# EAGLE design RAMPS2 (EAGLE 7.5.0)
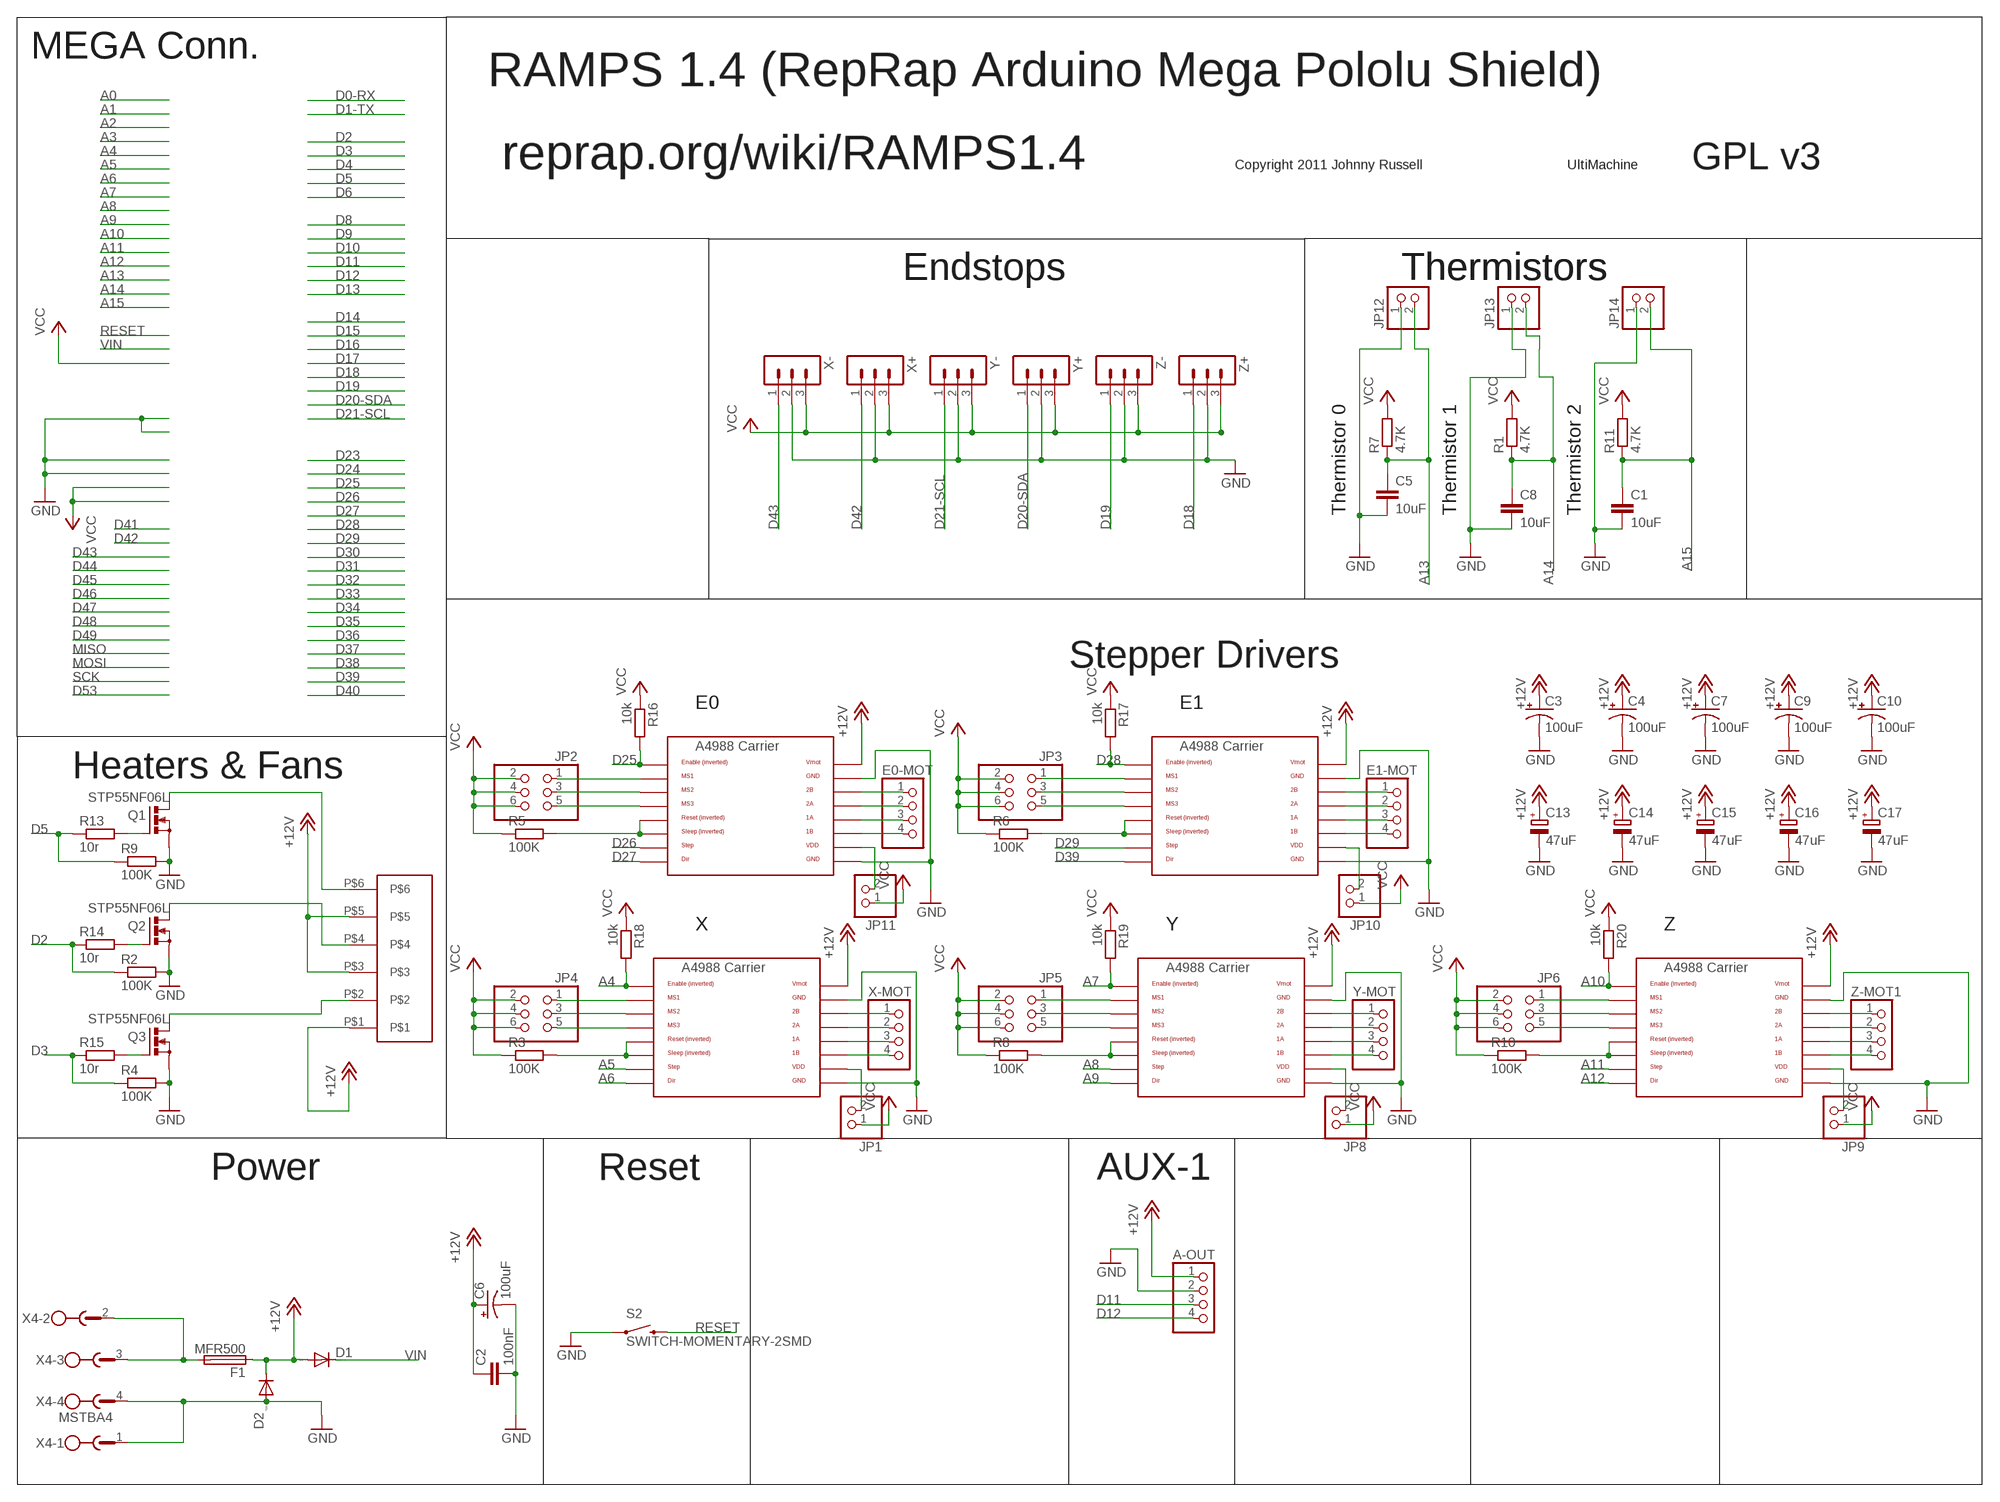
[diagram p0: schematic, sheet 1, part 1 of 3]
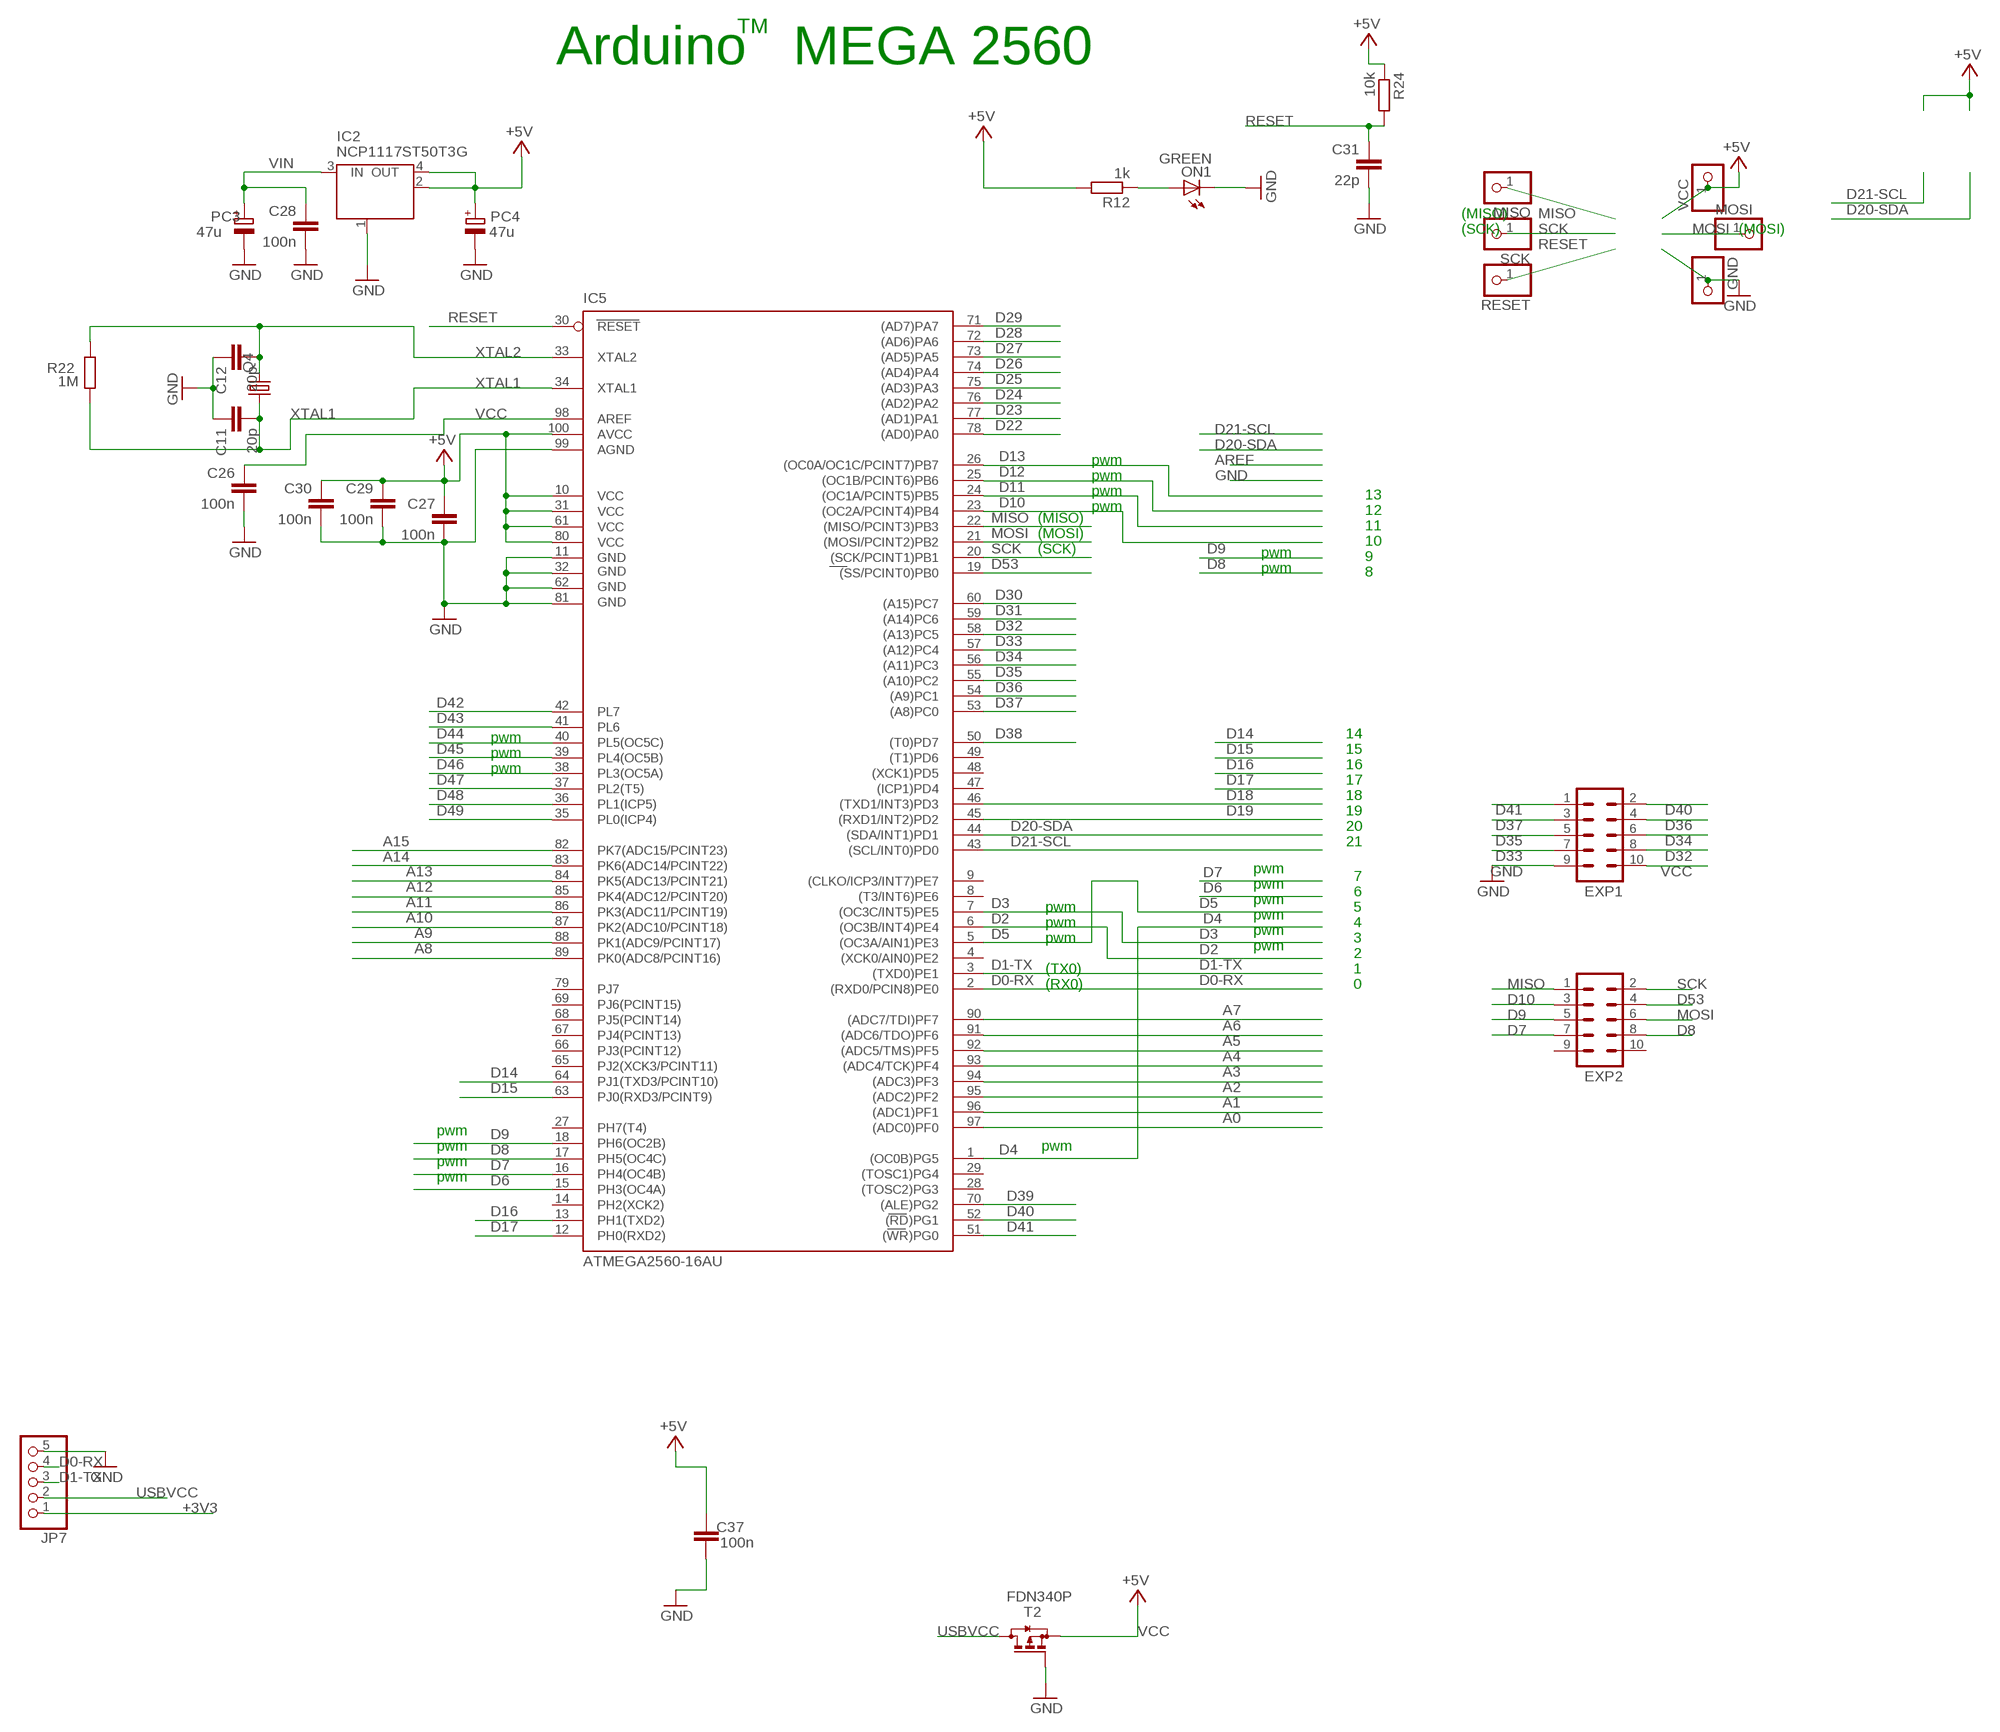
[diagram p1: schematic, sheet 1, part 2 of 3]
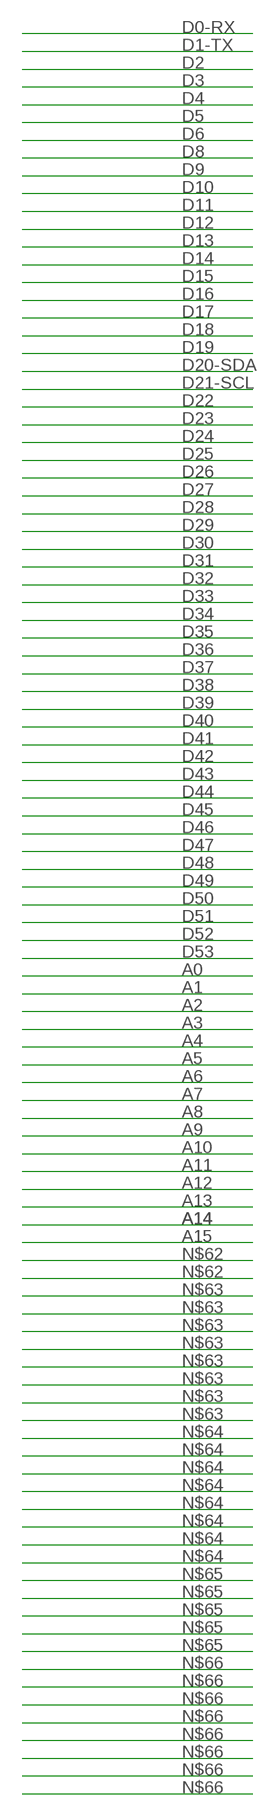
[diagram p2: schematic, sheet 1, part 3 of 3]

## Parts
A-OUT  PINHD-1X4  [1X04]
C1  10uF  C-EUC0805  [C0805]
C2  100nF  C-EUC0805  [C0805]
C3  100uF  CPOL-US153CLV-0605  [153CLV-0605]
C4  100uF  CPOL-US153CLV-0605  [153CLV-0605]
C5  10uF  C-EUC0805  [C0805]
C6  100uF  CPOL-US153CLV-0605  [153CLV-0605]
C7  100uF  CPOL-US153CLV-0605  [153CLV-0605]
C8  10uF  C-EUC0805  [C0805]
C9  100uF  CPOL-US153CLV-0605  [153CLV-0605]
C10  100uF  CPOL-US153CLV-0605  [153CLV-0605]
C11  20p  C-EUC0805  [C0805]
C12  20p  C-EUC0805  [C0805]
C13  47uF  CPOL-EUSMCE  [SMC_E]
C14  47uF  CPOL-EUSMCE  [SMC_E]
C15  47uF  CPOL-EUSMCE  [SMC_E]
C16  47uF  CPOL-EUSMCE  [SMC_E]
C17  47uF  CPOL-EUSMCE  [SMC_E]
C26  100n  C-EUC0805  [C0805]
C27  100n  C-EUC0805  [C0805]
C28  100n  C-EUC0603  [C0603]
C29  100n  C-EUC0805  [C0805]
C30  100n  C-EUC0805  [C0805]
C31  22p  C-EUC0805  [C0805]
C37  100n  C-EUC0805  [C0805]
D1  DIODE-DO-214AC  [DO-214AC]
D2  DIODE-DO-214AC  [DO-214AC]
E0-MOT  PINHD-1X4  [1X04]
E1-MOT  PINHD-1X4  [1X04]
EXP1  ML10  [ML10]
EXP2  ML10  [ML10]
F1  MFR500  PTCFUSE  [MFR500]
GND  PINHD-1X1  [1X01]
IC2  NCP1117ST50T3G  MC33269ST-3.3T3  [SOT223]
IC5  ATMEGA2560-16AU  ATMEGA25602560-16AU  [TQFP100]
JP1  PINHD-1X2  [1X02]
JP2  PINHD-2X3  [2X03]
JP3  PINHD-2X3  [2X03]
JP4  PINHD-2X3  [2X03]
JP5  PINHD-2X3  [2X03]
JP6  PINHD-2X3  [2X03]
JP7  PINHD-1X5  [1X05]
JP8  PINHD-1X2  [1X02]
JP9  PINHD-1X2  [1X02]
JP10  PINHD-1X2  [1X02]
JP11  PINHD-1X2  [1X02]
JP12  PINHD-1X2  [1X02]
JP13  PINHD-1X2  [1X02]
JP14  PINHD-1X2  [1X02]
MISO  PINHD-1X1  [1X01]
MOSI  PINHD-1X1  [1X01]
ON1  GREEN  LED1206  [LED1206]
PC3  47u  CPOL-EUD  [PANASONIC_D]
PC4  47u  CPOL-EUD  [PANASONIC_D]
Q1  STP55NF06L  IRF512  [TO220BV]
Q2  STP55NF06L  IRF512  [TO220BV]
Q3  STP55NF06L  IRF512  [TO220BV]
Q4  CRYSTALHC49S  [HC49/S]
R1  4.7K  R-EU_R0805  [R0805]
R2  100K  R-EU_R0805  [R0805]
R3  100K  R-EU_R0805  [R0805]
R4  100K  R-EU_R0805  [R0805]
R5  100K  R-EU_R0805  [R0805]
R6  100K  R-EU_R0805  [R0805]
R7  4.7K  R-EU_R0805  [R0805]
R8  100K  R-EU_R0805  [R0805]
R9  100K  R-EU_R0805  [R0805]
R10  100K  R-EU_R0805  [R0805]
R11  4.7K  R-EU_R0805  [R0805]
R12  1k  R-EU_R0805  [R0805]
R13  10r  R-EU_R0805  [R0805]
R14  10r  R-EU_R0805  [R0805]
R15  10r  R-EU_R0805  [R0805]
R16  10k  R-EU_R0805  [R0805]
R17  10k  R-EU_R0805  [R0805]
R18  10k  R-EU_R0805  [R0805]
R19  10k  R-EU_R0805  [R0805]
R20  10k  R-EU_R0805  [R0805]
R22  1M  R-EU_R0805  [R0805]
R24  10k  R-EU_R0805  [R0805]
RESET  PINHD-1X1  [1X01]
S2  SWITCH-MOMENTARY-2SMD  [TACTILE-SWITCH-SMD]
SCK  PINHD-1X1  [1X01]
T2  FDN340P  BSS84  [SOT23]
U$2  282837-6  [282837-6]
U$4  A4988BREAKOUT  [A4988BREAKOUT]
U$5  A4988BREAKOUT  [A4988BREAKOUT]
U$6  A4988BREAKOUT  [A4988BREAKOUT]
U$7  A4988BREAKOUT  [A4988BREAKOUT]
U$8  A4988BREAKOUT  [A4988BREAKOUT]
VCC  PINHD-1X1  [1X01]
X4  MSTBA4  [MSTBA4]
X+  3PIN-HEADER  [3PIN-HEADER]
X-  3PIN-HEADER  [3PIN-HEADER]
X-MOT  PINHD-1X4  [1X04]
Y+  3PIN-HEADER  [3PIN-HEADER]
Y-  3PIN-HEADER  [3PIN-HEADER]
Y-MOT  PINHD-1X4  [1X04]
Z+  3PIN-HEADER  [3PIN-HEADER]
Z-  3PIN-HEADER  [3PIN-HEADER]
Z-MOT1  PINHD-1X4  [1X04]

## Nets
+3V3 [power]: JP7.1
+12V: A-OUT.1 C2.1 C3.+ C4.+ C6.+ C7.+ C9.+ C10.+ C13.+ C14.+ C15.+ C16.+ C17.+ D1.A D2.C F1.1 U$2.P$1 U$2.P$3 U$2.P$5 U$4.VMOT U$5.VMOT U$6.VMOT U$7.VMOT U$8.VMOT
A0: IC5.97((ADC0)PF0)
A1: IC5.96((ADC1)PF1)
A2: IC5.95((ADC2)PF2)
A3: IC5.94((ADC3)PF3)
A4: IC5.93((ADC4/TCK)PF4) R18.2 U$6.EN
A5: IC5.92((ADC5/TMS)PF5) U$6.STEP
A6: IC5.91((ADC6/TDO)PF6) U$6.DIR
A7: IC5.90((ADC7/TDI)PF7) R19.2 U$7.EN
A8: IC5.89(PK0(ADC8/PCINT16)) U$7.STEP
A9: IC5.88(PK1(ADC9/PCINT17)) U$7.DIR
A10: IC5.87(PK2(ADC10/PCINT18)) R20.2 U$8.EN
A11: IC5.86(PK3(ADC11/PCINT19)) U$8.STEP
A12: IC5.85(PK4(ADC12/PCINT20)) U$8.DIR
A13: C5.1 IC5.84(PK5(ADC13/PCINT21)) JP12.2 R7.1
A14: C8.1 IC5.83(PK6(ADC14/PCINT22)) JP13.2 R1.1
A15: C1.1 IC5.82(PK7(ADC15/PCINT23)) JP14.2 R11.1
D0-RX: IC5.2((RXD0/PCIN8)PE0) JP7.4
D1-TX: IC5.3((TXD0)PE1) JP7.3
D2: IC5.6((OC3B/INT4)PE4) R2.1 R14.1
D3: IC5.7((OC3C/INT5)PE5) R4.1 R15.1
D4: IC5.1((OC0B)PG5)
D5: IC5.5((OC3A/AIN1)PE3) R9.1 R13.1
D6: IC5.15(PH3(OC4A))
D7: EXP2.7 IC5.16(PH4(OC4B))
D8: EXP2.8 IC5.17(PH5(OC4C))
D9: EXP2.5 IC5.18(PH6(OC2B))
D10: EXP2.3 IC5.23((OC2A/PCINT4)PB4)
D11: A-OUT.3 IC5.24((OC1A/PCINT5)PB5)
D12: A-OUT.4 IC5.25((OC1B/PCINT6)PB6)
D13: IC5.26((OC0A/OC1C/PCINT7)PB7)
D14: IC5.64(PJ1(TXD3/PCINT10))
D15: IC5.63(PJ0(RXD3/PCINT9))
D16: IC5.13(PH1(TXD2))
D17: IC5.12(PH0(RXD2))
D18: IC5.46((TXD1/INT3)PD3) Z+.1
D19: IC5.45((RXD1/INT2)PD2) Z-.1
D20-SDA: IC5.44((SDA/INT1)PD1) Y+.1
D21-SCL: IC5.43((SCL/INT0)PD0) Y-.1
D22: IC5.78((AD0)PA0)
D23: IC5.77((AD1)PA1)
D24: IC5.76((AD2)PA2)
D25: IC5.75((AD3)PA3) R16.2 U$4.EN
D26: IC5.74((AD4)PA4) U$4.STEP
D27: IC5.73((AD5)PA5) U$4.DIR
D28: IC5.72((AD6)PA6) R17.2 U$5.EN
D29: IC5.71((AD7)PA7) U$5.STEP
D30: IC5.60((A15)PC7)
D31: IC5.59((A14)PC6)
D32: EXP1.8 IC5.58((A13)PC5)
D33: EXP1.7 IC5.57((A12)PC4)
D34: EXP1.6 IC5.56((A11)PC3)
D35: EXP1.5 IC5.55((A10)PC2)
D36: EXP1.4 IC5.54((A9)PC1)
D37: EXP1.3 IC5.53((A8)PC0)
D38: IC5.50((T0)PD7)
D39: IC5.70((ALE)PG2) U$5.DIR
D40: EXP1.2 IC5.52((RD)PG1)
D41: EXP1.1 IC5.51((WR)PG0)
D42: IC5.42(PL7) X+.1
D43: IC5.41(PL6) X-.1
D44: IC5.40(PL5(OC5C))
D45: IC5.39(PL4(OC5B))
D46: IC5.38(PL3(OC5A))
D47: IC5.37(PL2(T5))
D48: IC5.36(PL1(ICP5))
D49: IC5.35(PL0(ICP4))
D53: EXP2.4 IC5.19((SS/PCINT0)PB0)
GND: A-OUT.2 C1.2 C2.2 C3.- C4.- C5.2 C6.- C7.- C8.2 C9.- C10.- C11.1 C12.1 C13.- C14.- C15.- C16.- C17.- C26.2 C27.2 C28.2 C29.2 C30.2 C31.2 C37.1 D2.A EXP1.9 GND.1 IC2.1(GND/ADJ) IC5.11(GND) IC5.32(GND1) IC5.62(GND2) IC5.81(GND3) IC5.99(AGND) JP7.5 JP12.1 JP13.1 JP14.1 ON1.C PC3.- PC4.- Q1.S Q2.S Q3.S R2.2 R4.2 R9.2 S2.1 T2.1(G) U$4.GND U$4.GND@0(GND) U$5.GND U$5.GND@0(GND) U$6.GND U$6.GND@0(GND) U$7.GND U$7.GND@0(GND) U$8.GND U$8.GND@0(GND) X4.1 X4.4 X+.2 X-.2 Y+.2 Y-.2 Z+.2 Z-.2
MISO: EXP2.1 IC5.22((MISO/PCINT3)PB3) MISO.1
MOSI: EXP2.6 IC5.21((MOSI/PCINT2)PB2) MOSI.1
N$1: Q2.D U$2.P$4
N$2: F1.2 X4.2 X4.3
N$3: E0-MOT.1 U$4.2B
N$4: E0-MOT.2 U$4.2A
N$5: JP2.1 U$4.MS1
N$6: JP2.5 U$4.MS3
N$7: Q1.D U$2.P$6
N$8: R5.2 U$4.RST U$4.SLP(SLEEP)
N$9: JP2.3 U$4.MS2
N$10: E0-MOT.3 U$4.1A
N$11: E0-MOT.4 U$4.1B
N$12: E1-MOT.1 U$5.2B
N$13: E1-MOT.2 U$5.2A
N$14: JP4.1 U$6.MS1
N$15: JP4.3 U$6.MS2
N$16: E1-MOT.3 U$5.1A
N$17: JP5.3 U$7.MS2
N$18: E1-MOT.4 U$5.1B
N$19: JP4.5 U$6.MS3
N$20: R3.2 U$6.RST U$6.SLP(SLEEP)
N$21: U$6.2B X-MOT.1
N$22: U$6.2A X-MOT.2
N$23: R8.2 U$7.RST U$7.SLP(SLEEP)
N$24: R6.2 U$5.RST U$5.SLP(SLEEP)
N$25: JP3.1 U$5.MS1
N$26: U$6.1A X-MOT.3
N$27: U$6.1B X-MOT.4
N$28: U$7.2B Y-MOT.1
N$29: U$7.2A Y-MOT.2
N$30: U$7.1A Y-MOT.3
N$31: JP5.5 U$7.MS3
N$32: JP11.2 U$4.VDD
N$33: JP5.1 U$7.MS1
N$34: JP3.5 U$5.MS3
N$35: JP3.3 U$5.MS2
N$36: U$7.1B Y-MOT.4
N$37: JP6.3 U$8.MS2
N$38: R10.2 U$8.RST U$8.SLP(SLEEP)
N$39: JP6.5 U$8.MS3
N$40: JP6.1 U$8.MS1
N$41: U$8.2B Z-MOT1.1
N$42: U$8.2A Z-MOT1.2
N$43: U$8.1A Z-MOT1.3
N$44: U$8.1B Z-MOT1.4
N$45: JP1.2 U$6.VDD
N$46: JP8.2 U$7.VDD
N$47: Q2.G R14.2
N$48: Q1.G R13.2
N$49: Q3.G R15.2
N$50: JP9.2 U$8.VDD
N$51: Q3.D U$2.P$2
N$52: JP10.2 U$5.VDD
N$55: C26.1 IC5.98(AREF)
N$57: ON1.A R12.1
RESET: C31.1 IC5.30(RESET) R24.2 RESET.1 S2.3
SCK: EXP2.2 IC5.20((SCK/PCINT1)PB1) SCK.1
USBVCC [5V]: JP7.2 T2.3(D)
VCC: C27.1 C29.1 C30.1 C37.2 EXP1.10 IC2.2(OUT) IC2.4(OUT) IC5.10(VCC) IC5.31(VCC1) IC5.61(VCC2) IC5.80(VCC3) IC5.100(AVCC) JP1.1 JP2.2 JP2.4 JP2.6 JP3.2 JP3.4 JP3.6 JP4.2 JP4.4 JP4.6 JP5.2 JP5.4 JP5.6 JP6.2 JP6.4 JP6.6 JP8.1 JP9.1 JP10.1 JP11.1 PC4.+ R1.2 R3.1 R5.1 R6.1 R7.2 R8.1 R10.1 R11.2 R12.2 R16.1 R17.1 R18.1 R19.1 R20.1 R24.1 T2.2(S) VCC.1 X+.3 X-.3 Y+.3 Y-.3 Z+.3 Z-.3 ; supply symbol labelled +5V
VIN [power]: C28.1 D1.C IC2.3(IN) PC3.+
XTAL1: C11.2 IC5.34(XTAL1) Q4.1 R22.1
XTAL2: C12.2 IC5.33(XTAL2) Q4.2 R22.2
Unconnected: EXP2.9 EXP2.10 IC5.4((XCK0/AIN0)PE2) IC5.8((T3/INT6)PE6) IC5.9((CLKO/ICP3/INT7)PE7) IC5.14(PH2(XCK2)) IC5.27(PH7(T4)) IC5.28((TOSC2)PG3) IC5.29((TOSC1)PG4) IC5.47((ICP1)PD4) IC5.48((XCK1)PD5) IC5.49((T1)PD6) IC5.65(PJ2(XCK3/PCINT11)) IC5.66(PJ3(PCINT12)) IC5.67(PJ4(PCINT13)) IC5.68(PJ5(PCINT14)) IC5.69(PJ6(PCINT15)) IC5.79(PJ7)

## Notes on the sheet
- TM
- Arduino   MEGA 2560
- MEGA Conn. | (MISO)
- (SCK) | (MOSI)
- RAMPS 1.4 (RepRap Arduino Mega Pololu Shield)
- reprap.org/wiki/RAMPS1.4 | Copyright 2011 Johnny Russell | UltiMachine | GPL v3
- Endstops | Thermistors | Thermistors | pwm
- pwm
- pwm | 13
- pwm | 12
- (MISO)
- 11
- (MOSI)
- 10
- (SCK) | pwm
- 9
- pwm | 8
- Thermistor 0 | Thermistor 1 | Thermistor 2
- pwm | 14
- pwm | 15
- pwm | 16
- 17
- 18
- 19
- 20
- 21
- pwm
- 7
- pwm
- Stepper Drivers | 6
- pwm
- pwm | 5
- pwm
- pwm | 4
- pwm
- E0 | E1 | pwm | 3
- pwm
- 2
- (TX0) | 1
- (RX0) | 0
- Heaters & Fans
- pwm
- pwm | pwm
- pwm
- pwm
- X | Y | Z
- Power | Reset | AUX-1

## Library data of the parts
A-OUT E0-MOT E1-MOT X-MOT Y-MOT Z-MOT1 = RepRapjr:PINHD-1X4: PIN HEADER
C1 C2 C5 C8 C11 C12 C26-C31 C37 = rcl:C-EU: CAPACITOR, European symbol
C3 C4 C6 C7 C9 C10 = adafruit:CPOL-US: POLARIZED CAPACITOR, American symbol
C13-C17 PC3 PC4 = rcl:CPOL-EU: POLARIZED CAPACITOR, European symbol
D1 D2 = diode:DIODE-: DIODE
EXP1 EXP2 = con-harting-ml:ML10: HARTING; OC_FARNELL: unknown; OC_NEWARK: unknown
F1 = RepRapjr:PTCFUSE: LITTLEFUSE Picofuse/slow Littlefuse
GND MISO MOSI RESET SCK VCC = pinhead:PINHD-1X1: PIN HEADER
IC2 = linear:MC33269ST*: Adjustable Output Low Dropout Voltage Regulator 800 mA Source: http://www.onsemi.com/pub/Collateral/MC33269-D.PDF
IC5 = SmartPrj:ATMEGA2560: MICROCONTROLLER 64/128/256 Kbytes FLASH 4 Kbytes EEPROM 8 Kbytes SRAM 86 General Purpose I/O pins 12-channels16-bit PWM 4 x Serial USARTs 16-channels 10-bit A/D
JP1 JP8-JP14 = pinhead:PINHD-1X2: PIN HEADER
JP2-JP6 = pinhead:PINHD-2X3: PIN HEADER
JP7 = pinhead:PINHD-1X5: PIN HEADER
ON1 = Namenlos:LED1206
Q1-Q3 = transistor-power:IRF512: N-CHANNEL MOS FET
Q4 = Namenlos at:CRYSTAL: CRYSTAL; OC_FARNELL: 1667008; OC_NEWARK: unknown
R1-R20 R22 R24 = rcl:R-EU_: RESISTOR, European symbol
S2 = SparkFun-Electromechanical:SWITCH-MOMENTARY-2: Various NO switches- pushbuttons, reed, etc; PROD_ID: SWCH-08247
T2 = transistor-small-signal:BSS84: P-CHANNEL MOS FET
U$2 = RepRapjr:282837-6
U$4-U$8 = RepRapjr:A4988BREAKOUT
X4 = con-phoenix-508:MSTBA4: PHOENIX; MF: FARNELL; MPN: 1757268; OC_FARNELL: 3705195; OC_NEWARK: 71C4163
X+ X- Y+ Y- Z+ Z- = ultimachine:3PIN-HEADER: PIN HEADER

## Net classes
0 default: width 0.203 mm, drill 0.508 mm, clearance 0.203 mm
1 power: width 0.61 mm, drill 0.406 mm, clearance 0.203 mm
2 gnd: width 0.381 mm, drill 0.508 mm, clearance 0.254 mm
3 5V: width 0.381 mm, drill 0.508 mm, clearance 0.254 mm

## Board
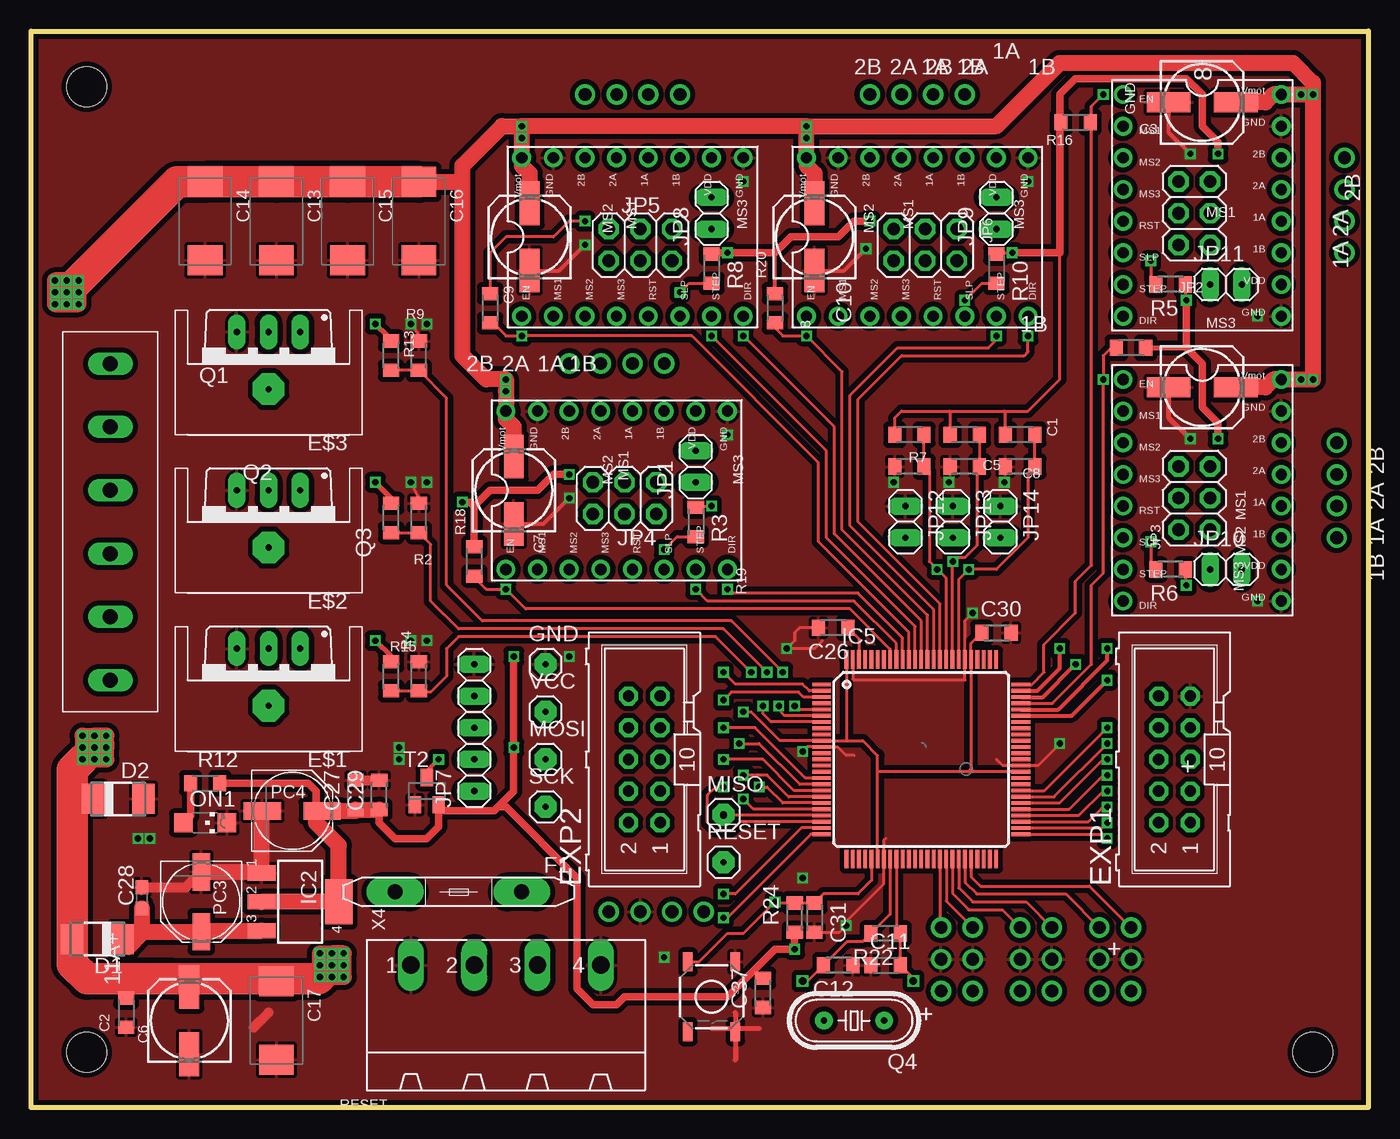
[diagram p3: board, top side]
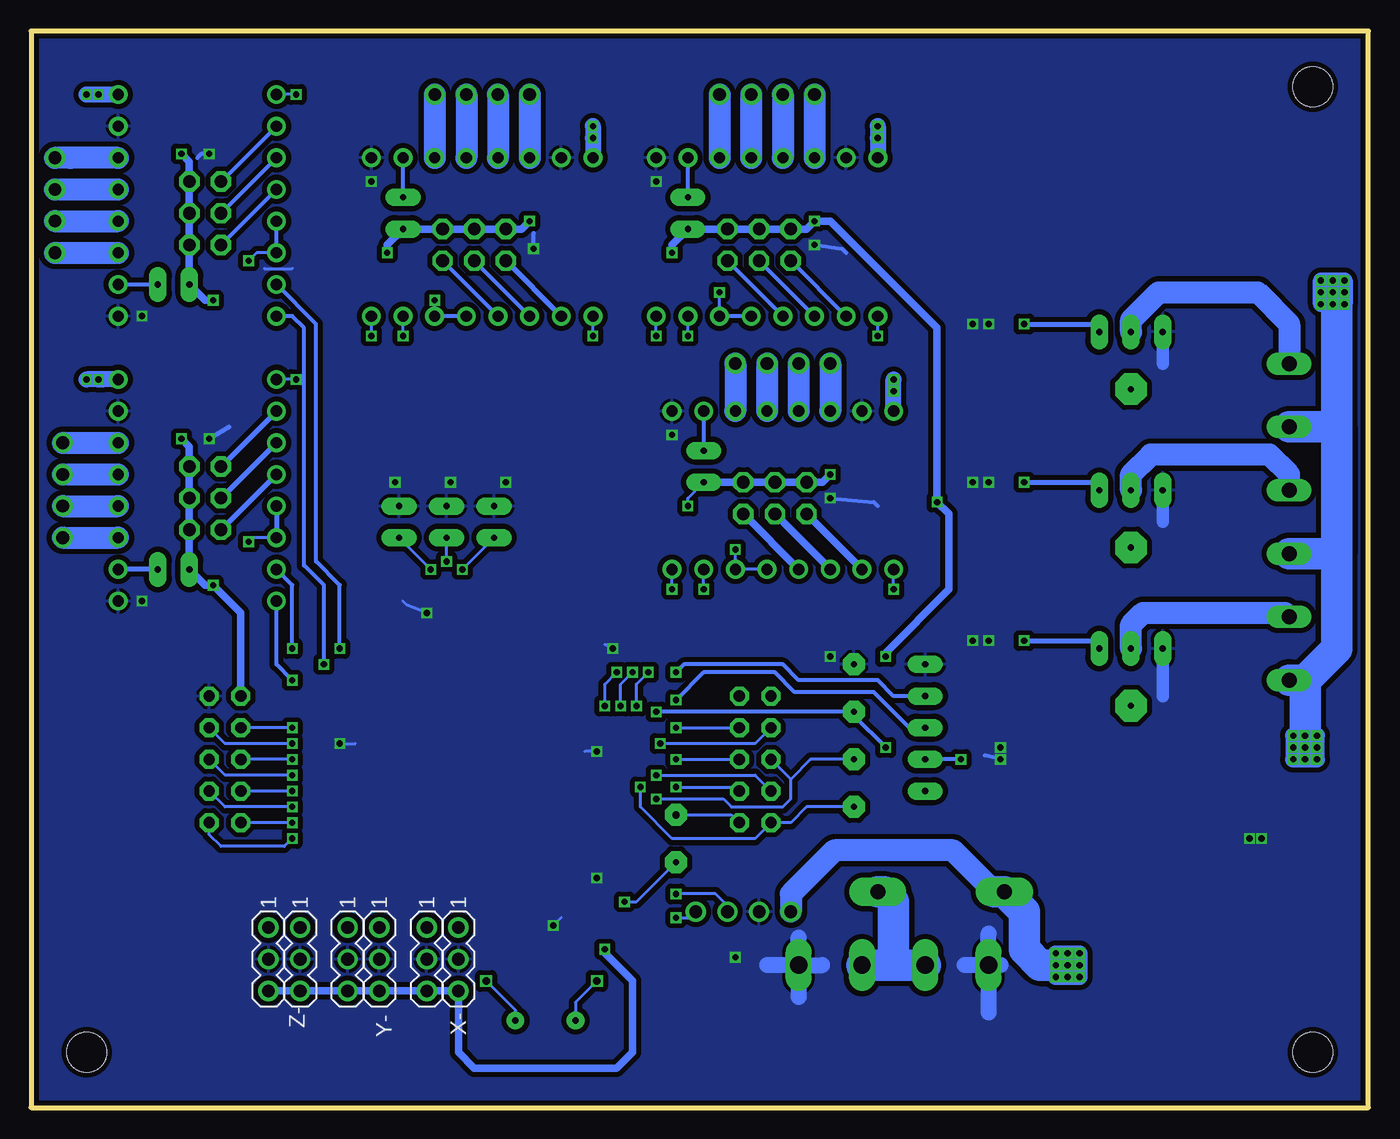
[diagram p4: board, bottom side, seen from below]

Size 107.31 x 86.36 mm. Coordinates in mm from the lower left corner, seen from the top.
Outline: 0,0 0,86.36 107.31,86.36 107.31,0 0,0
Copper layers (1*16): Top 0.035mm / dielectric 1.5mm / Bottom 0.035mm
Design rules "GoldPhoenix *": minimum track width 20mil, minimum drill 15mil, track to track 7mil, track to pad 7mil, pad to pad 7mil, via to via 7mil, smd to smd 7mil, copper to edge 1mil, drill to drill 8mil, minimum pad ring 12mil, minimum via ring 7mil, stop-mask expansion 4mil, vias tented up to drill 25mil, thermal gap 10mil
Holes 3.2 mm at 4.45,81.92 102.87,4.45 4.45,4.45

### Footprints (pad centres in the part's own frame; a part is rotated, then mirrored left to right if it is on the bottom)
1X04 = drill 1.016: 1 -2.54,0; 2 0,0; 3 2.54,0; 4 5.08,0
C0805 = smd 1.05 x 1.3: 1 -1.175,0; 2 1.175,0
153CLV-0605 = smd 3.5 x 1.6: + 2.7,0; - -2.7,0
SMC_E = smd 2.4 x 2.8: + -3.15,0; - 3.15,0
C0603 = smd 1.1 x 1: 1 -0.85,0; 2 0.85,0
DO-214AC = smd 1.8 x 2.4: A 2.025,0; C -2.025,0
SK95-3M3 = drill 0.5 pad 2.54 octagon: P$1 0,2.05
ML10 = drill 0.914 octagon: 1 -5.08,-1.27; 2 -5.08,1.27; 3 -2.54,-1.27; 4 -2.54,1.27; 5 0,-1.27; 6 0,1.27; 7 2.54,-1.27; 8 2.54,1.27; 9 5.08,-1.27; 10 5.08,1.27
MFR500 = drill 1.2 pad 2.3 long: 1 -5.08,0; 2 5.08,0
1X01 = drill 0.5 pad 1.778 octagon: 1 0,0
SOT223 = smd 1.219 x 2.235: 1 -2.311,-3.099; 2 0,-3.099; 3 2.311,-3.099 | smd 3.6 x 2.2: 4 0,3.099
TQFP100 = smd 1.5 x 0.3: 1 -8,6; 2 -8,5.5; 3 -8,5; 4 -8,4.5; 5 -8,4; 6 -8,3.5; 7 -8,3; 8 -8,2.5; 9 -8,2; 10 -8,1.5; 11 -8,1; 12 -8,0.5; 13 -8,0; 14 -8,-0.5; 15 -8,-1; 16 -8,-1.5; 17 -8,-2; 18 -8,-2.5; 19 -8,-3; 20 -8,-3.5; 21 -8,-4; 22 -8,-4.5; 23 -8,-5; 24 -8,-5.5; 25 -8,-6; 51 8,-6; 52 8,-5.5; 53 8,-5; 54 8,-4.5; 55 8,-4; 56 8,-3.5; 57 8,-3; 58 8,-2.5; 59 8,-2; 60 8,-1.5; 61 8,-1; 62 8,-0.5; 63 8,0; 64 8,0.5; 65 8,1; 66 8,1.5; 67 8,2; 68 8,2.5; 69 8,3; 70 8,3.5; 71 8,4; 72 8,4.5; 73 8,5; 74 8,5.5; 75 8,6 | smd 0.3 x 1.5: 26 -6,-8; 27 -5.5,-8; 28 -5,-8; 29 -4.5,-8; 30 -4,-8; 31 -3.5,-8; 32 -3,-8; 33 -2.5,-8; 34 -2,-8; 35 -1.5,-8; 36 -1,-8; 37 -0.5,-8; 38 0,-8; 39 0.5,-8; 40 1,-8; 41 1.5,-8; 42 2,-8; 43 2.5,-8; 44 3,-8; 45 3.5,-8; 46 4,-8; 47 4.5,-8; 48 5,-8; 49 5.5,-8; 50 6,-8; 76 6,8; 77 5.5,8; 78 5,8; 79 4.5,8; 80 4,8; 81 3.5,8; 82 3,8; 83 2.5,8; 84 2,8; 85 1.5,8; 86 1,8; 87 0.5,8; 88 0,8; 89 -0.5,8; 90 -1,8; 91 -1.5,8; 92 -2,8; 93 -2.5,8; 94 -3,8; 95 -3.5,8; 96 -4,8; 97 -4.5,8; 98 -5,8; 99 -5.5,8; 100 -6,8
1X02 = drill 0.5 pad 1.422 long: 1 -1.27,0; 2 1.27,0
2X03 = drill 1.016 octagon: 1 -2.54,-1.27; 2 -2.54,1.27; 3 0,-1.27; 4 0,1.27; 5 2.54,-1.27; 6 2.54,1.27
1X05 = drill 0.5 pad 1.422 long: 1 -5.08,0; 2 -2.54,0; 3 0,0; 4 2.54,0; 5 5.08,0
LED1206 = smd 1.5 x 1.5: A 0,-1.75; C 0,1.75
PANASONIC_D = smd 3 x 1.4: + 2.4,0; - -2.4,0
TO220BV = drill 0.5 pad 1.422 long: D 0,-2.54; G -2.54,-2.54; S 2.54,-2.54
HC49/S = drill 0.5 pad 1.422: 1 -2.413,0; 2 2.413,0
R0805 = smd 1.05 x 1.3: 1 -1.175,0; 2 1.175,0
TACTILE-SWITCH-SMD = smd 1.524 x 0.762: 1 -2.794,1.905; 2 2.794,1.905; 3 -2.794,-1.905; 4 2.794,-1.905
SOT23 = smd 1 x 1.4: 1 -0.95,-1.1; 2 0.95,-1.1; 3 0,1.1
282837-6 = drill 1.2 long: P$1 0,-12.7; P$2 0,-7.62; P$3 0,-2.54; P$4 0,2.54; P$5 0,7.62; P$6 0,12.7
A4988BREAKOUT = drill 0.9: 1A 8.89,1.27; 1B 11.43,1.27; 2A 6.35,1.27; 2B 3.81,1.27; DIR 16.51,-11.43; EN -1.27,-11.43; GND 16.51,1.27; GND@0 1.27,1.27; MS1 1.27,-11.43; MS2 3.81,-11.43; MS3 6.35,-11.43; RST 8.89,-11.43; SLP 11.43,-11.43; STEP 13.97,-11.43; VDD 13.97,1.27; VMOT -1.27,1.27
MSTBA4 = drill 1.397 long: 1 -7.62,5.08; 2 -2.54,5.08; 3 2.54,5.08; 4 7.62,5.08
3PIN-HEADER = drill 1.016: 1 -2.54,0; 2 0,0; 3 2.54,0

### Placement (x,y rotation side)
A-OUT  48.9,15.72 180 bottom
C1  79.38,51.44 180 top
C2  7.62,7.62 270 top
C3  93.98,80.64 0 top
C4  93.98,57.78 0 top
C5  70.48,51.44 180 top
C6  12.7,6.99 90 top
C7  38.73,49.53 90 top
C8  74.93,51.44 180 top
C9  40.01,69.85 90 top
C10  62.87,69.85 90 top
C11  68.58,11.43 0 top
C12  64.77,11.43 180 top
C13  19.68,71.12 270 top
C14  13.97,71.12 270 top
C15  25.4,71.12 270 top
C16  31.11,71.12 270 top
C17  19.68,6.99 270 top
C26  64.37,38.5 180 top
C27  26.04,25.08 90 top
C28  8.89,16.83 90 top
C29  27.94,25.08 90 top
C30  77.47,38.1 0 top
C31  62.87,15.24 270 top
C37  58.74,9.21 90 top
D1  5.31,13.52 180 top
D2  6.99,24.77 0 top
E0-MOT  105.41,73.66 270 top
E1-MOT  104.78,50.8 270 top
E$1  [SK95-3M3]  19.05,34.29 180 top
E$2  [SK95-3M3]  19.05,46.99 180 top
E$3  [SK95-3M3]  19.05,59.69 180 top
EXP1  91.76,27.94 90 top
EXP2  49.21,27.94 90 top
F1  34.29,17.3 0 top
GND  41.27,35.56 0 top
IC2  21.59,16.51 270 top
IC5  71.44,27.94 0 top
JP1  53.34,51.44 90 top
JP2  93.34,71.75 270 top
JP3  93.34,48.9 270 top
JP4  47.62,48.9 0 top
JP5  48.9,69.22 0 top
JP6  71.75,69.22 0 top
JP7  35.56,30.48 90 top
JP8  54.61,71.75 90 top
JP9  77.47,71.75 90 top
JP10  95.89,43.18 0 top
JP11  95.89,66.04 0 top
JP12  70.17,46.99 270 top
JP13  73.98,46.99 270 top
JP14  77.79,46.99 270 top
MISO  55.56,23.5 0 top
MOSI  41.27,27.94 0 top
ON1  13.97,22.86 270 top
PC3  13.65,16.51 270 top
PC4  20.95,23.81 0 top
Q1  19.05,59.69 180 top
Q2  19.05,46.99 180 top
Q3  19.05,34.29 180 top
Q4  66.04,6.99 180 top
R1  74.93,53.98 180 top
R2  31.11,47.31 90 top
R3  53.34,46.99 270 top
R4  31.11,34.61 90 top
R5  91.44,66.04 180 top
R6  91.44,43.18 180 top
R7  70.48,53.98 180 top
R8  54.61,67.31 270 top
R9  31.11,60.33 90 top
R10  77.47,67.31 270 top
R11  79.38,53.98 180 top
R12  13.97,26.04 0 top
R13  28.89,60.33 90 top
R14  28.89,47.31 90 top
R15  28.89,34.61 90 top
R16  83.82,79.06 0 top
R17  88.27,60.96 180 top
R18  35.56,43.81 270 top
R19  36.83,64.14 270 top
R20  59.69,64.14 270 top
R22  68.58,13.97 180 top
R24  61.28,15.24 90 top
RESET  55.56,19.68 0 top
S2  54.61,8.89 270 top
SCK  41.27,24.13 0 top
T2  31.75,25.4 0 top
U$2  6.35,46.99 0 top
U$4  99.06,80.01 270 top
U$5  99.06,57.15 270 top
U$6  39.37,54.61 0 top
U$7  40.64,74.93 0 top
U$8  63.5,74.93 0 top
VCC  41.27,31.75 0 top
X4  38.1,6.35 0 top
X+  75.56,11.91 270 bottom
X-  73.03,11.91 270 bottom
X-MOT  45.72,59.69 0 top
Y+  81.92,11.91 270 bottom
Y-  79.38,11.91 270 bottom
Y-MOT  46.99,81.28 180 bottom
Z+  88.27,11.91 270 bottom
Z-  85.72,11.91 270 bottom
Z-MOT1  69.85,81.28 0 top

### Tracks (layer width: path | path; a pad name or v marks a point on that pad's centre or on a via)
+12V  (via drill 0.5, 0.5 pad 0.81)
  Top 0.254: 97.31,58.42 C4.+ | v1.91,64.45 2.22,64.45 2.54,64.77 2.54,65.09 v2.86,65.41 | v2.86,64.45 v2.86,65.41 | v1.91,65.41 v2.86,65.41 | v2.86,66.36 v2.86,65.41 | v3.81,64.45 v2.86,65.41 | v3.81,65.41 v2.86,65.41
  Top 0.61: 62.87,72.87 C10.+ | D2.C 3.92,24.77 3.28,25.4
  Top 0.813: 6.67,10 6.99,10.32
  Top 1.016: C2.1 7.62,10.32
  Top 1.27: C4.+ 99.06,57.78 99.69,58.42 U$5.VMOT v102.87,58.42 v102.87,81.28 | C3.+ 99.06,80.64 99.69,81.28 U$4.VMOT v102.87,81.28 | 62.87,72.87 62.87,74.93 62.23,75.56 U$8.VMOT v62.23,78.74 | C9.+ 40.01,74.93 39.37,75.56 U$7.VMOT v39.37,78.74 | C7.+ 38.73,54.61 38.1,55.24 U$6.VMOT v38.1,57.47 v38.1,58.42 36.51,58.42 34.61,60.33 34.61,74.3 | v62.23,78.74 v39.37,78.74 | v62.23,78.74 77.47,78.74 82.55,83.82 101.28,83.82 102.87,82.23 v102.87,81.28 | 34.61,74.3 34.61,75.56 37.78,78.74 v39.37,78.74 | C16.+ 34.58,74.27 34.61,74.3 | v25.08,12.38 v25.08,10.48 v24.13,10.48 | v25.08,12.38 v24.13,12.38 v24.13,11.43 v24.13,10.48 | v4.13,27.94 v5.08,27.94 v6.03,27.94 v6.03,28.89 6.03,29.21 v6.03,29.84 v5.08,29.84 v4.13,29.84 v4.13,28.89 | v25.08,12.38 v23.18,12.38 v23.18,11.43 v23.18,10.48 v24.13,10.48 | C17.+ 20.14,10.13 20.32,10.32 | C6.+ 12.7,10.32 | v1.91,64.45 v2.86,64.45 v3.81,64.45 v3.81,65.41 v3.81,66.36 v2.86,66.36 v1.91,66.36 v1.91,65.41 v1.91,64.45
  Top 2.54: C16.+ C15.+ C13.+ C14.+ 11.72,74.27 v2.86,65.41 | v5.08,28.89 v4.13,27.94 3.28,27.1 3.28,25.4 D1.A 3.28,11.52 4.49,10.32 6.99,10.32 7.62,10.32 11.43,10.32 12.7,10.32 20.32,10.32 23.02,10.32 v23.18,10.48 v24.13,11.43
  Bottom 1.27: v102.87,81.28 v101.92,81.28 U$4.VMOT | U$5.VMOT 101.6,58.42 v101.92,58.42 v102.87,58.42 | v62.23,78.74 v62.23,77.79 U$8.VMOT | v39.37,78.74 v39.37,77.79 U$7.VMOT | U$6.VMOT v38.1,58.42 | v4.13,29.84 v6.03,29.84 v6.03,27.94 v4.13,27.94 v4.13,29.84 | v4.13,29.84 v5.08,29.84 v5.08,28.89 | v23.18,11.43 v23.18,10.48 v25.08,10.48 v25.08,12.38 v23.18,12.38 v23.18,11.43 | v1.91,64.45 v3.81,64.45 v3.81,66.36 v1.91,66.36 v1.91,64.45
  Bottom 1.778: 30,17.3 33.34,20.64 42.86,20.64 46.35,17.14 A-OUT.1
  Bottom 2.54: U$2.P$1 5.08,34.29 | 5.08,34.29 2.54,36.83 2.54,44.45 | 2.54,44.45 U$2.P$3 | U$2.P$5 2.54,54.61 | 2.54,54.61 2.54,44.45 | 30,17.3 F1.1 27.62,15.72 27.62,12.7 26.35,11.43 v25.08,11.43 v24.13,11.43 | v5.08,28.89 5.08,34.29 | 2.54,54.61 2.54,65.09 v2.86,65.41
A4  (via drill 0.5 pad 0.81)
  Top 0.254: IC5.93 68.94,36.79 65.72,40.01 39.69,40.01 v38.1,41.59 36.51,41.59 35.56,42.55 R18.2
  Bottom 0.254: v38.1,41.59 U$6.EN
A5  (via drill 0.5 pad 0.81)
  Top 0.254: IC5.92 69.44,37.24 66.04,40.64 54.29,40.64 v53.34,41.59
  Bottom 0.254: v53.34,41.59 U$6.STEP
A6  (via drill 0.5 pad 0.81)
  Top 0.254: IC5.91 69.94,37.7 66.36,41.27 56.2,41.27 v55.88,41.59
  Bottom 0.254: v55.88,41.59 U$6.DIR
A7  (via drill 0.5 pad 0.81)
  Top 0.254: IC5.90 70.44,38.15 63.18,45.4 63.18,51.75 53.02,61.91 v39.37,61.91 38.1,61.91 37.05,62.96 R19.2
  Bottom 0.254: v39.37,61.91 U$7.EN
A8  (via drill 0.5 pad 0.81)
  Top 0.254: IC5.89 70.94,38.6 63.82,45.72 63.82,52.7 v54.61,61.91
  Bottom 0.254: v54.61,61.91 U$7.STEP
A9  (via drill 0.5 pad 0.81)
  Top 0.254: IC5.88 71.44,39.05 64.45,46.04 64.45,54.61 v57.15,61.91
  Bottom 0.254: v57.15,61.91 U$7.DIR
A10  (via drill 0.5 pad 0.81)
  Top 0.254: IC5.87 71.94,39.51 65.09,46.35 65.09,59.05 v62.23,61.91 60.33,61.91 59.69,62.55 R20.2
  Bottom 0.254: v62.23,61.91 U$8.EN
A11  (via drill 0.5 pad 0.81)
  Top 0.254: IC5.86 72.44,39.96 65.72,46.67 65.72,57.15 69.53,60.96 76.83,60.96 77.47,61.59 v77.47,61.91
  Bottom 0.254: v77.47,61.91 U$8.STEP
A12  (via drill 0.5 pad 0.81)
  Top 0.254: IC5.85 72.94,40.41 66.36,46.99 66.36,56.83 69.85,60.33 79.69,60.33 80.01,60.64 v80.01,61.91
  Bottom 0.254: v80.01,61.91 U$8.DIR
A13  (via drill 0.5 pad 0.81)
  Top 0.254: IC5.84 73.44,42.45 v72.71,43.18 72.07,43.81 72.07,51.02 C5.1 R7.1
  Bottom 0.254: v72.71,43.18 JP12.2
A14  (via drill 0.5 pad 0.81)
  Top 0.254: 73.94,45.68 JP13.2 | IC5.83 73.94,43.77 v73.98,43.81 74.3,44.13 74.93,44.13 75.88,45.09 75.88,51.21 C8.1 R1.1
  Bottom 0.254: v73.98,43.81 JP13.2
A15  (via drill 0.5 pad 0.81)
  Top 0.254: IC5.82 74.44,42.37 v75.25,43.18 77.47,43.18 80.01,45.72 80.01,50.9 C1.1 R11.1
  Bottom 0.254: v75.25,43.18 JP14.2
D0-RX  (via drill 0.5 pad 0.81)
  Top 0.254: IC5.2 62.45,33.44 61.91,33.97 56.52,33.97 v55.56,34.92
  Top 0.305: 55.78,34.71 v55.56,34.92
  Bottom 0.305: JP7.4 38.1,33.02 39.37,34.29 45.72,34.29 46.99,35.56 54.93,35.56 v55.56,34.92
D1-TX  (via drill 0.5 pad 0.81)
  Top 0.254: IC5.3 61.99,32.94 61.59,33.34 56.2,33.34 v55.56,32.7
  Top 0.305: 55.8,32.94 v55.56,32.7
  Bottom 0.305: JP7.3 36.83,30.48 39.69,33.34 46.04,33.34 47.62,34.92 53.34,34.92 v55.56,32.7
D2  (via drill 0.5 pad 0.81)
  Top 0.254: IC5.6 60.48,31.44 60.01,31.91 v60.01,32.23 | R14.1 R2.1 32.07,45.18 32.07,40.64 34.29,38.42 55.56,38.42 v59.05,34.92
  Bottom 0.254: v60.01,32.23 60.01,33.97 v59.05,34.92
D3  (via drill 0.5 pad 0.81)
  Top 0.254: IC5.7 59.39,30.94 58.74,31.59 v58.74,32.23 | R15.1 R4.1 31.21,33.34 32.07,33.34 33.34,34.61 33.34,36.83 34.29,37.78 54.93,37.78 v57.78,34.92
  Bottom 0.254: v58.74,32.23 58.74,33.97 v57.78,34.92
D5  (via drill 0.5 pad 0.81)
  Top 0.254: IC5.5 61.56,31.94 v61.28,32.23 | R13.1 R9.1 33.34,56.93 33.34,41.91 36.2,39.05 56.2,39.05 v60.33,34.92
  Bottom 0.254: v61.28,32.23 61.28,33.97 v60.33,34.92
D7  (via drill 0.5 pad 0.81)
  Top 0.254: v55.56,30.48 58.1,30.48 62.14,26.44 IC5.16
  Bottom 0.254: v55.56,30.48 EXP2.7
D8  (via drill 0.5 pad 0.81)
  Top 0.254: v56.83,29.21 58.42,29.21 61.69,25.94 IC5.17
  Bottom 0.254: EXP2.8 49.21,29.21 v56.83,29.21
D9  (via drill 0.5 pad 0.81)
  Top 0.254: v55.56,27.94 58.74,27.94 61.24,25.44 IC5.18
  Bottom 0.254: v55.56,27.94 EXP2.5
D10  (via drill 0.5 pad 0.81)
  Top 0.254: v55.56,25.72 54.93,25.72 54.29,25.08 54.29,22.86 54.93,22.23 56.2,22.23 56.91,22.94 IC5.23
  Bottom 0.254: v55.56,25.72 50.8,25.72 EXP2.3
D11  (via drill 0.5 pad 0.81)
  Top 0.254: IC5.24 61.81,22.44 56.52,17.14 v55.56,17.14
  Bottom 0.254: A-OUT.3 51.44,16.19 52.39,17.14 v55.56,17.14
D12  (via drill 0.5 pad 0.81)
  Top 0.254: IC5.25 62.58,21.94 55.88,15.24 v55.56,15.24
  Bottom 0.254: v55.56,15.24 54.45,15.24 A-OUT.4
D18
  Top 0.254: IC5.46 75.44,18.54 76.2,17.78 84.93,17.78 Z+.1
D19
  Top 0.254: IC5.45 74.94,18.09 75.88,17.14 83.03,17.14 Z-.1
D20-SDA
  Top 0.254: IC5.44 74.44,17.64 75.56,16.51 79.85,16.51 Y+.1
D21-SCL
  Top 0.254: IC5.43 73.94,17.18 75.25,15.88 77.95,15.88 Y-.1
D25  (via drill 0.5 pad 0.81)
  Top 0.254: IC5.75 80.3,33.94 81.28,34.92 81.28,37.15 83.82,39.69 83.82,42.23 85.09,43.5 85.09,78.74 | 85.09,78.74 85.09,80.33 v86.04,81.28 | R16.2 85,78.83 85.09,78.74
  Bottom 0.254: v86.04,81.28 U$4.EN
D26  (via drill 0.5 pad 0.81)
  Top 0.305: IC5.74 80.75,33.44 82.55,35.24 v82.55,36.83
  Bottom 0.305: v82.55,36.83 82.55,41.91 84.45,43.81 84.45,62.87 U$4.STEP
D27  (via drill 0.5 pad 0.81)
  Top 0.305: IC5.73 81.2,32.94 v83.82,35.56
  Bottom 0.305: v83.82,35.56 83.82,41.91 85.41,43.5 85.41,62.55 86.36,63.5 U$4.DIR
D28  (via drill 0.5 pad 0.81)
  Top 0.254: IC5.72 81.97,32.44 85.09,35.56 85.09,41.91 86.04,42.86 v86.04,58.42 86.04,60.33 86.68,60.96 R17.2
  Bottom 0.254: v86.04,58.42 U$5.EN
D29  (via drill 0.5 pad 0.81)
  Top 0.305: IC5.71 82.42,31.94 86.36,35.88 v86.36,36.83
  Bottom 0.305: v86.36,36.83 86.36,41.91 U$5.STEP
D32  (via drill 0.5 pad 0.81)
  Top 0.254: IC5.58 81.32,25.44 v86.36,30.48
  Bottom 0.254: v86.36,30.48 EXP1.8
D33  (via drill 0.5 pad 0.81)
  Top 0.254: IC5.57 82.09,24.94 v86.36,29.21
  Bottom 0.254: v86.36,29.21 91.76,29.21 EXP1.7
D34  (via drill 0.5 pad 0.81)
  Top 0.254: IC5.56 82.54,24.44 86.04,27.94 v86.36,27.94
  Bottom 0.254: v86.36,27.94 EXP1.6
D35  (via drill 0.5 pad 0.81)
  Top 0.254: IC5.55 83.31,23.94 86.04,26.67 v86.36,26.67
  Bottom 0.254: v86.36,26.67 91.76,26.67 EXP1.5
D36  (via drill 0.5 pad 0.81)
  Top 0.254: IC5.54 84.08,23.44 86.04,25.4 v86.36,25.4
  Bottom 0.254: v86.36,25.4 EXP1.4
D37  (via drill 0.5 pad 0.81)
  Top 0.254: IC5.53 84.85,22.94 86.04,24.13 v86.36,24.13
  Bottom 0.254: v86.36,24.13 91.76,24.13 EXP1.3
D39  (via drill 0.5 pad 0.81)
  Top 0.305: IC5.70 83.51,31.44 v86.36,34.29
  Bottom 0.305: v86.36,34.29 87.63,35.56 U$5.DIR
D40  (via drill 0.5 pad 0.81)
  Top 0.254: IC5.52 85.94,22.44 v86.36,22.86
  Bottom 0.254: v86.36,22.86 EXP1.2
D41  (via drill 0.5 pad 0.81)
  Top 0.254: IC5.51 86.01,21.94 v86.36,21.59
  Bottom 0.254: v86.36,21.59 87,20.95 92.08,20.95 93.03,21.91 EXP1.1
D42
  Top 0.254: IC5.42 73.44,16.57 X+.1
D43
  Top 0.254: IC5.41 72.94,14.53 X-.1
D53  (via drill 0.5 pad 0.81)
  Top 0.254: v57.15,26.67 59.05,26.67 60.78,24.94 IC5.19
  Bottom 0.254: EXP2.4 49.21,26.67 v57.15,26.67
GND  (via drill 0.5 pad 0.81)
  Top 0.254: 74.94,39.06 v75.56,39.69 74.94,39.06 | C31.2 64.86,14.06 v65.41,14.61 65.41,14.92 68.44,17.95 IC5.32 | R2.2 31.11,48.9 v30.48,50.16 | R9.2 31.11,61.91 v30.48,62.87 | R4.2 31.11,36.2 | v82.55,29.21 80.78,27.44 80.01,27.44 IC5.62 77.97,27.44 77.47,27.94 | 63.5,37.47 62.87,36.83 v60.64,36.83 61.3,37.49 61.3,38.12 61.59,38.42 61.67,38.5 C26.2 | 66.04,28.26 65.41,28.26 64.72,28.94 IC5.11 62.28,28.94 v61.91,28.57 | IC5.99 65.94,34.39 66.04,34.29 74.93,34.29 74.94,34.3 74.94,35.56 IC5.81 74.94,39.05 | 74.94,39.05 74.93,39.05 | IC5.32 68.44,20.32 | 68.44,20.32 68.44,21.45 68.58,21.59 | IC5.32 68.44,20.32 | 74.94,39.05 74.94,39.06
  Top 0.305: C7.- 41.12,46.83 v43.18,48.9 | C9.- 42.38,67.15 v44.45,69.22 | C3.- 91.28,78.27 v93.03,76.52 | C10.- 65.25,67.15 v66.99,68.9
  Top 0.406: C4.- 91.28,55.4 v93.03,53.66 | 54.61,6.35 58.42,6.35 | 56.52,7.62 56.52,3.81
  Top 0.813: C27.2 C29.2 | 18.49,23.75 PC4.- | C28.2 12.42,17.68 PC3.- | 17.88,6.45 19.05,7.62
  Top 1.27: 18.49,23.75 IC2.1 18.4,18.91 PC3.-
  Bottom 0.254: v65.41,14.61 64.77,15.24 | v75.56,39.69 77.15,40.32 77.47,40.64 | v60.64,36.83 61.28,37.15 | v30.48,50.16 30.16,50.16 30.48,50.48 | 30.8,63.18 v30.48,62.87 | v82.55,29.21 81.28,29.21 | v61.91,28.57 62.87,28.57 | 88.58,67.31 86.36,67.31
  Bottom 0.305: v43.18,48.9 39.69,48.58 39.37,48.26 | v44.45,69.22 42.23,68.9 41.91,68.58 | v93.03,76.52 93.66,76.52 93.98,76.2 | v66.99,68.9 66.99,70.17 | v29.53,27.94 30.8,28.26
  Bottom 0.406: v93.03,53.66 91.44,54.61
  Bottom 1.016: Q1.S 16.51,59.69 | Q2.S 16.51,46.99 | Q3.S 16.51,33.02
  Bottom 1.27: X4.1 30.48,7.62 | X4.4 48.26,11.43 | X4.4 45.72,13.65 | X4.4 43.81,11.43 | X4.4 45.72,8.89 | X4.1 32.38,11.43 | X4.1 30.48,13.97 | X4.1 29.53,11.43
  other vias: 30.48,37.47 9.53,21.59 69.22,50.16 73.66,50.16 78.11,50.16 50.8,12.06 43.18,36.2 98.42,63.5 98.42,40.64 80.01,74.3 57.15,74.3 55.88,53.98 8.57,21.59 29.53,28.89 31.75,37.47 31.75,50.16 31.75,62.87 61.91,18.41
  pour Bottom (isolate 0.406): 107.31,0 107.31,86.36 0,86.36 0,0
  pour Top (isolate 0.406): 0,86.36 107.31,86.36 107.31,0 0,0
MISO  (via drill 0.6 pad 0.81)
  Top 0.254: IC5.22 55.62,23.44 MISO.1
  Bottom 0.254: MISO.1 51.12,23.5 EXP2.1
  other vias: 55.56,23.5
MOSI  (via drill 0.5 pad 0.81)
  Top 0.254: IC5.21 57.98,23.94 v57.15,24.77
  Bottom 0.254: v57.15,24.77 51.75,24.77 51.12,24.13 46.99,24.13 46.35,24.77 46.35,26.35 | 46.35,26.35 EXP2.6 | MOSI.1 44.77,27.94 46.35,26.35
N$1
  Bottom 1.778: Q2.D 19.05,50.8 17.46,52.39 7.94,52.39 6.35,50.8 U$2.P$4
N$2
  Bottom 2.54: X4.2 38.1,11.43 | 38.1,11.43 X4.3 | F1.2 38.89,17.3 38.1,16.51 38.1,11.43
N$3
  Bottom 1.778: U$4.2B 104.14,76.2 E0-MOT.1
N$4
  Bottom 1.27: U$4.2A
  Bottom 1.778: E0-MOT.2 U$4.2A
N$5
  Bottom 0.305: U$4.MS1 JP2.1
N$6
  Bottom 0.305: U$4.MS3 JP2.5
N$7
  Bottom 1.778: Q1.D 19.05,63.18 16.83,65.41 8.89,65.41 6.35,62.87 U$2.P$6
N$8  (via drill 0.5 pad 0.81)
  Top 0.254: v89.85,67.94 89.85,66.45 R5.2
  Top 0.305: R5.2 90.17,66.04
  Bottom 0.254: U$4.SLP 89.22,68.58 v89.85,67.94
  Bottom 0.305: U$4.SLP U$4.RST
N$9
  Bottom 0.305: JP2.3 U$4.MS2
N$10
  Bottom 1.27: U$4.1A
  Bottom 1.778: E0-MOT.3 U$4.1A
N$11
  Bottom 1.27: U$4.1B
  Bottom 1.778: E0-MOT.4 U$4.1B
N$12
  Bottom 1.778: E1-MOT.1 U$5.2B
N$13
  Bottom 1.778: E1-MOT.2 U$5.2A
N$14
  Bottom 0.61: U$6.MS1 JP4.1
N$15
  Bottom 0.61: U$6.MS2 JP4.3
N$16
  Bottom 1.778: E1-MOT.3 U$5.1A
N$17
  Bottom 0.305: JP5.3 U$7.MS2
N$18
  Bottom 1.778: E1-MOT.4 U$5.1B
N$19
  Bottom 0.61: JP4.5 U$6.MS3
N$20  (via drill 0.5 pad 0.81)
  Top 0.254: 52.93,45.4 R3.2 51.85,45.81 v50.8,44.77
  Bottom 0.254: U$6.RST U$6.SLP v50.8,44.77
N$21
  Bottom 1.778: X-MOT.1 U$6.2B
N$22
  Bottom 1.778: X-MOT.2 U$6.2A
N$23  (via drill 0.5 pad 0.81)
  Top 0.254: v52.07,65.41 52.8,66.14 R8.2
  Bottom 0.254: U$7.SLP v52.07,65.41
  Bottom 0.305: U$7.RST U$7.SLP
N$24  (via drill 0.5 pad 0.81)
  Top 0.254: v89.85,45.4 89.85,43.59 R6.2
  Top 0.406: R6.2 90.17,43.18
  Bottom 0.254: U$5.SLP 89.53,45.72 v89.85,45.4
  Bottom 0.406: U$5.RST U$5.SLP
N$25
  Bottom 0.406: U$5.MS1 JP3.1
N$26
  Bottom 1.778: X-MOT.3 U$6.1A
N$27
  Bottom 1.778: X-MOT.4 U$6.1B
N$28
  Bottom 1.778: Y-MOT.1 U$7.2B
N$29
  Bottom 1.778: Y-MOT.2 U$7.2A
N$30
  Bottom 1.778: Y-MOT.3 U$7.1A
N$31
  Bottom 0.305: U$7.MS3 JP5.5
N$32
  Bottom 0.305: U$4.VDD JP11.2
N$33
  Bottom 0.305: U$7.MS1 JP5.1
N$34
  Bottom 0.406: U$5.MS3 JP3.5
N$35
  Bottom 0.406: U$5.MS2 JP3.3
N$36
  Bottom 1.778: Y-MOT.4 U$7.1B
N$37
  Bottom 0.305: JP6.3 U$8.MS2
N$38  (via drill 0.5 pad 0.81)
  Top 0.254: v74.93,64.77 76.3,66.14 R10.2
  Top 0.305: R10.2 77.47,66.04
  Bottom 0.254: U$8.SLP v74.93,64.77
  Bottom 0.305: U$8.RST U$8.SLP
N$39
  Bottom 0.305: U$8.MS3 JP6.5
N$40
  Bottom 0.406: U$8.MS1 JP6.1
N$41
  Bottom 1.778: Z-MOT1.1 U$8.2B
N$42
  Bottom 1.778: Z-MOT1.2 U$8.2A
N$43
  Bottom 1.778: Z-MOT1.3 U$8.1A
N$44
  Bottom 1.778: Z-MOT1.4 U$8.1B
N$45
  Bottom 0.305: U$6.VDD JP1.2
N$46
  Bottom 0.305: JP8.2 U$7.VDD
N$47  (via drill 0.5 pad 0.81)
  Top 0.254: R14.2 28.89,48.9
  Top 0.406: 28.89,48.9 v27.62,50.16
  Bottom 0.406: v27.62,50.16 22.23,50.16 Q2.G
N$48  (via drill 0.5 pad 0.81)
  Top 0.254: R13.2 28.57,61.91
  Top 0.406: 28.57,61.91 v27.62,62.87
  Bottom 0.406: v27.62,62.87 22.23,62.87 Q1.G
N$49  (via drill 0.5 pad 0.81)
  Top 0.254: R15.2 28.89,36.2
  Top 0.406: 28.89,36.2 v27.62,37.47
  Bottom 0.406: v27.62,37.47 22.23,37.47 Q3.G
N$50
  Bottom 0.305: JP9.2 U$8.VDD
N$51
  Bottom 1.778: Q3.D 19.05,38.73 18.1,39.69 6.67,39.69 U$2.P$2
N$52
  Bottom 0.406: JP10.2 U$5.VDD
N$55
  Top 0.254: C26.1 66.44,37.61 IC5.98
N$57
  Top 0.61: R12.1 12.79,23.43 ON1.A
RESET  (via drill 0.5 pad 0.81)
  Top 0.254: IC5.30 67.44,18.23 66.36,17.14 63.59,17.14 C31.1 R24.2 59.78,16.41 v59.69,16.51 57.15,13.97 55.88,13.97 53.59,11.68 S2.3
  Bottom 0.254: v59.69,16.51 58.74,16.51 RESET.1
SCK  (via drill 0.5 pad 0.81)
  Top 0.254: v58.42,25.72 59.05,25.72 60.33,24.44 IC5.20
  Bottom 0.254: v58.42,25.72 58.42,24.13 55.88,21.59 49.21,21.59 EXP2.2 46.35,22.86 45.09,24.13 SCK.1
USBVCC  (via drill 0.5 pad 0.81)
  Top 0.305: T2.3 31.75,26.99 v32.7,27.94
  Bottom 0.305: v32.7,27.94 JP7.2
VCC  (via drill 0.5, 0.5 pad 0.81)
  Top 0.254: 67.94,26.99 IC5.31 | 67.94,26.99 67.94,28.25 | 67.94,28.25 67.94,28.26 | 65.41,29.44 IC5.10 60.09,29.44 57.78,31.75 v57.15,31.75 | 65.41,29.44 66.75,29.44 67.94,28.25 | 65.41,29.44 65.44,29.47 IC5.100 65.38,35.88 | IC5.61 75.25,26.94 | 75.25,26.94 67.98,26.94 67.94,26.99 | 75.25,26.94 75.44,27.13 IC5.80 75.44,37.24 C30.1 | R3.1 53.44,48.26 v54.61,48.26 | R8.1 54.7,68.58 | v44.45,71.12 43.18,71.12 41.91,69.85 38.1,69.85 36.83,68.58 R19.1 | R10.1 77.56,68.58 v78.74,68.58 | 82.55,68.58 82.55,58.42 80.01,55.88 78.11,55.88 | R6.1 92.61,42.01 v92.71,41.91 | R5.1 92.61,64.86 v92.71,64.77 | R16.1 82.64,78.83 82.55,78.74 | R7.2 69.31,55.34 69.85,55.88 73.66,55.88 | 73.66,55.88 78.11,55.88 | R11.2 78.2,55.78 78.11,55.88 | R1.2 73.75,55.78 73.66,55.88 | C37.2 58.33,10.79 57.78,10.79
  Top 0.305: R20.1 59.69,68.58
  Top 0.406: R17.1 92.71,60.96
  Top 0.61: R18.1 35.56,48.26 | 35.56,48.26 36.83,49.53 40.64,49.53 41.91,50.8 v43.18,50.8 | R24.1 v61.28,12.7 59.69,12.7 57.78,10.79 55.88,8.89 47.62,8.89 46.99,8.26 45.09,8.26 43.81,9.53 43.81,18.41 38.1,24.13 37.47,24.13 | 37.47,24.13 38.73,25.4 v38.73,28.89 v38.73,36.2 | 37.47,24.13 37.15,23.81 33.19,23.81 T2.2 | 54.7,68.58 v55.88,68.58 59.69,68.58 60.96,69.85 64.77,69.85 66.04,71.12 v67.31,71.12 | v78.74,68.58 82.55,68.58 82.55,78.74 82.55,81.28 83.82,82.55 92.71,82.55 93.98,81.28 93.98,78.74 95.25,77.47 v95.25,76.52 | v95.25,53.66 95.25,54.93 93.98,56.2 93.98,59.69 92.71,60.96 v92.71,64.77 | T2.2 32.7,23.49 | v34.61,48.58 35.24,48.58 35.56,48.26 | R12.2 22.25,26.01 22.86,25.4 22.86,24.31 PC4.+ | T2.2 32.7,22.54 31.75,21.59 29.21,21.59 27.94,22.86 C29.1
  Top 1.27: IC2.2 IC2.4 24.69,21.03 22.86,22.86 22.86,23.32 PC4.+ 26.04,23.81 C27.1 C29.1
  Bottom 0.254: v54.61,48.26 54.61,48.9 JP1.1 | v38.73,36.2 38.73,36.51
  Bottom 0.305: v38.73,28.89 41.27,31.43 VCC.1 v57.15,31.75
  Bottom 0.61: Z+.3 Z-.3 Y+.3 Y-.3 X+.3 X-.3 73.03,4.45 71.75,3.17 60.33,3.17 59.05,4.45 59.05,10.16 61.28,12.38 v61.28,12.7 | JP1.1 JP4.6 JP4.4 JP4.2 43.81,50.16 v43.18,50.8 | v55.88,68.58 55.88,69.22 JP8.1 JP5.6 JP5.4 JP5.2 45.09,70.48 v44.45,71.12 43.18,71.12 34.61,62.55 v34.61,48.58 33.66,47.62 33.66,41.59 38.73,36.51 | v78.74,68.58 78.74,69.22 JP9.1 JP6.6 JP6.4 JP6.2 67.94,70.48 v67.31,71.12 | v95.25,53.66 94.61,53.02 JP3.2 JP3.4 JP3.6 JP10.1 93.34,41.91 v92.71,41.91 90.49,39.69 EXP1.10 | v92.71,64.77 93.34,64.77 JP11.1 JP2.6 JP2.4 JP2.2 94.61,75.88 v95.25,76.52
VIN
  Top 0.813: PC3.+ 13.74,14.2 | D1.C 7.81,12.89
  Top 1.27: 13.74,14.2 IC2.3 | 7.81,12.89 8.89,13.97 | 8.89,13.97 9.03,14.11 PC3.+ | C28.1 8.89,13.97
XTAL1  (via drill 0.6)
  Top 0.254: IC5.34 69.44,14.29 R22.1 C11.2 70.8,10.38 v70.8,10.16
  Bottom 0.254: v70.8,10.16 68.45,7.81 Q4.1
XTAL2  (via drill 0.6)
  Top 0.254: IC5.33 68.94,15.5 R22.2 | 67.41,14.06 R22.2 | R22.2 66.77,13.34 65.5,13.34 C12.2 62.33,10.16 v61.91,10.16
  Bottom 0.254: v61.91,10.16 63.63,8.45 Q4.2

### Text on the board
tNames: 1A | 8 | 2B | 2A | 1A | 2B | 1B | 2A | 1B | GND | 2B | 2A | MS1 | MS2 | MS1 | MS3 | MS2 | MS1 | MS3 | 1A | 8 | MS3 | 1B | 2B | 2A | 1A | 1B | 2B | MS2 | MS1 | MS3 | 2A | MS1 | 1A | MS2 | 1B | MS3 | + | + | 11A+ | + | + | RESET
_tsilk: + | I2C | END STOPS | 21 | + | E0 | 1 | S | 20 | D10 | 1 | - | - | E1 | + | + | + | D9 | T0 | T1 | T2 | + | 1 | + | D8 | 1 | 1 | 1 | U | X | Y | Z | + | + | - | 1 | + | PS | AUX-4 | AUX-1 | AUX-2 | AUX-3 | + | - | s | s | 1 | - | + | UltiMachine | 1 | SERVOS | 1 | reprap.org/wiki/RAMPS | V1.4 | -